# Altium schematic sheet Plan sommaire.SchDoc
size 635 x 457 mm
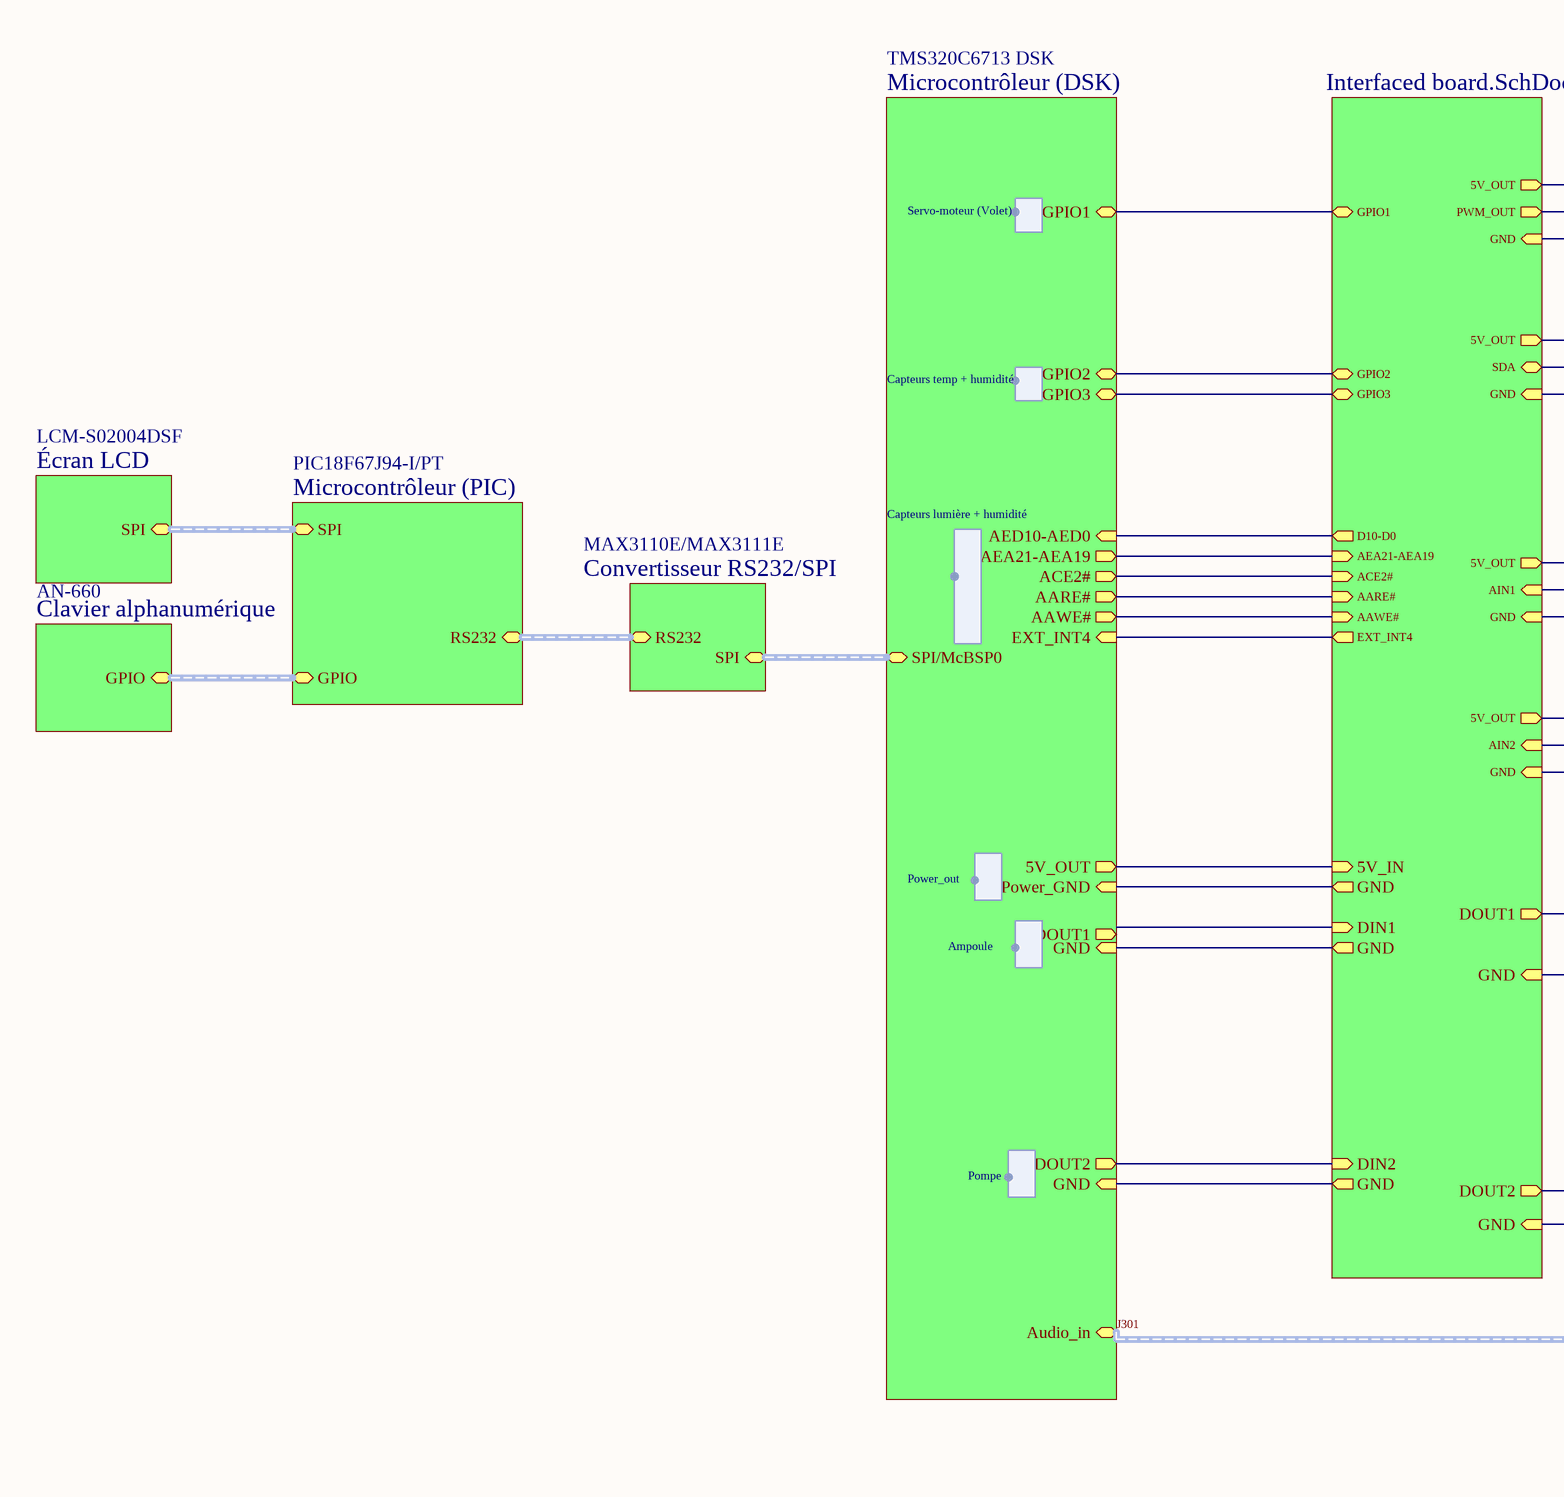
[diagram p0: Plan sommaire.SchDoc, left]
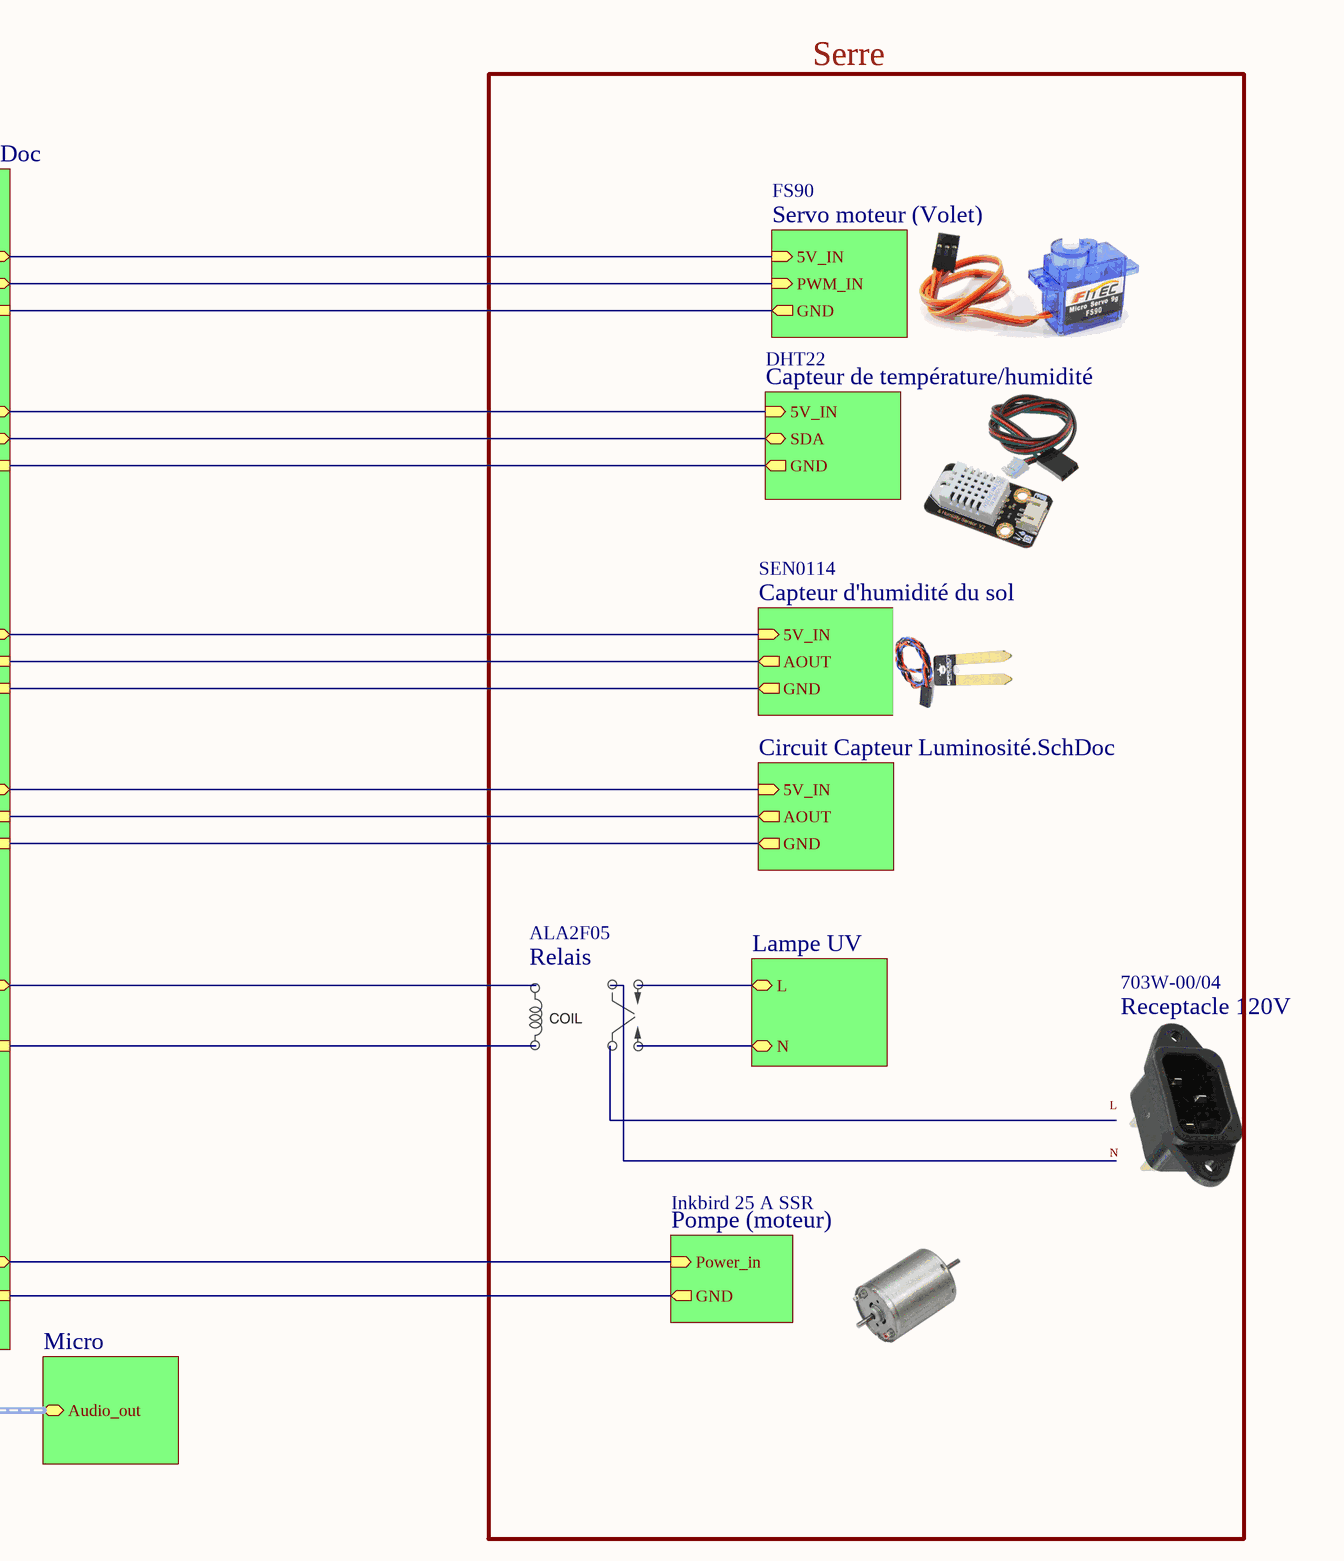
[diagram p1: Plan sommaire.SchDoc, right]

## Sub-sheets
AN-660 = Clavier alphanumérique: GPIO
DHT22 = Capteur de température/humidité: 5V_IN (in), SDA (bidir), GND (out)
FS90 = Servo moteur (Volet): PWM_IN (in), 5V_IN (in), GND (out)
Inkbird 25 A SSR = Pompe (moteur): Power_in (in), GND (out)
LCM-S02004DSF = Écran LCD: SPI
MAX3110E/MAX3111E = Convertisseur RS232/SPI: RS232, SPI
PIC18F67J94-I/PT = Microcontrôleur (PIC): SPI, GPIO, RS232
SEN0114 = Capteur d'humidité du sol: AOUT (out), 5V_IN (in), GND (out)
TMS320C6713 DSK = Microcontrôleur (DSK): SPI/McBSP0, GPIO1, 5V_OUT (out), DOUT2 (out), Audio_in, GND (in), Power_GND (in), DOUT1 (out), GND (in), AEA21-AEA19 (out), AED10-AED0 (in), ACE2# (out), AARE# (out), AAWE# (out), EXT_INT4 (in), GPIO2, GPIO3
? = Micro: Audio_out
? = Lampe UV: L, N
? = Circuit Capteur Luminosité.SchDoc: AOUT (out), 5V_IN (in), GND (out)
? = Interfaced board.SchDoc: DIN2 (in), GND (out), DIN1 (in), GND (out), DOUT1 (out), GND (in), DOUT2 (out), GND (in), GND (out), 5V_IN (in), 5V_OUT (out), AIN1 (in), GND (in), 5V_OUT (out), AIN2 (in), GND (in), D10-D0 (out), AEA21-AEA19 (in), ACE2# (in), AARE# (in), AAWE# (in), EXT_INT4 (out), 5V_OUT (out), PWM_OUT (out), GND (in), 5V_OUT (out), SDA (bidir), GND (in), GPIO1, GPIO2, GPIO3

## Harnesses
Power_out: 
Ampoule: 
Pompe: 
Capteurs lumière + humidité: 
Capteurs temp + humidité: 
Servo-moteur (Volet): 

## Nets
(unnamed): sheet TMS320C6713 DSK/GPIO1, sheet /GPIO1
(unnamed): sheet TMS320C6713 DSK/5V_OUT, sheet /5V_IN
(unnamed): sheet TMS320C6713 DSK/DOUT2, sheet /DIN2
(unnamed): sheet TMS320C6713 DSK/GND, sheet /GND
(unnamed): sheet TMS320C6713 DSK/Power_GND, sheet /GND
(unnamed): sheet TMS320C6713 DSK/GND, sheet /GND
(unnamed): sheet TMS320C6713 DSK/AEA21-AEA19, sheet /AEA21-AEA19
(unnamed): sheet TMS320C6713 DSK/AED10-AED0, sheet /D10-D0
(unnamed): sheet TMS320C6713 DSK/ACE2#, sheet /ACE2#
(unnamed): sheet TMS320C6713 DSK/AARE#, sheet /AARE#
(unnamed): sheet TMS320C6713 DSK/AAWE#, sheet /AAWE#
(unnamed): sheet TMS320C6713 DSK/EXT_INT4, sheet /EXT_INT4
(unnamed): sheet TMS320C6713 DSK/GPIO2, sheet /GPIO2
(unnamed): sheet TMS320C6713 DSK/GPIO3, sheet /GPIO3
(unnamed): sheet DHT22/5V_IN, sheet /5V_OUT
(unnamed): sheet DHT22/SDA, sheet /SDA
(unnamed): sheet DHT22/GND, sheet /GND
(unnamed): sheet SEN0114/AOUT, sheet /AIN1
(unnamed): sheet SEN0114/5V_IN, sheet /5V_OUT
(unnamed): sheet SEN0114/GND, sheet /GND
(unnamed): sheet /AOUT, sheet /AIN2
(unnamed): sheet /5V_IN, sheet /5V_OUT
(unnamed): sheet /GND, sheet /GND
(unnamed): sheet FS90/PWM_IN, sheet /PWM_OUT
(unnamed): sheet FS90/5V_IN, sheet /5V_OUT
(unnamed): sheet FS90/GND, sheet /GND
(unnamed): sheet Inkbird 25 A SSR/Power_in, sheet /DOUT2
(unnamed): sheet Inkbird 25 A SSR/GND, sheet /GND

## Buses and harness runs
harness J301 = sheet /Audio_out = sheet TMS320C6713 DSK/Audio_in
harness sheet AN-660/GPIO = sheet PIC18F67J94-I/PT/GPIO
harness sheet LCM-S02004DSF/SPI = sheet PIC18F67J94-I/PT/SPI
harness sheet MAX3110E/MAX3111E/RS232 = sheet PIC18F67J94-I/PT/RS232
harness sheet MAX3110E/MAX3111E/SPI = sheet TMS320C6713 DSK/SPI/McBSP0

## Notes on the sheet
- Serre
- Relais
- ALA2F05
- Receptacle 120V
- 703W-00/04
- Labels drawn without touching a wire or pin: L